# Altium project project.PrjPcb (part 2 of 2)

## Sheet klmag2gend-b031.SchDoc: EMMC
size A4; Date: 10.08.2025; CheckedBy: BCY; DrawnBy: miaow; DocumentNumber: 9; Revision: v0.0.1; SheetNumber: 9; SheetTotal: 12; Sample: A0; Url: github.com/miaow-cn/pcb-lib; Liscense: GPLv3; Board: MIAOW FOC BOARD; BoardType: MAIN_PCB; Desc: High speed DDR
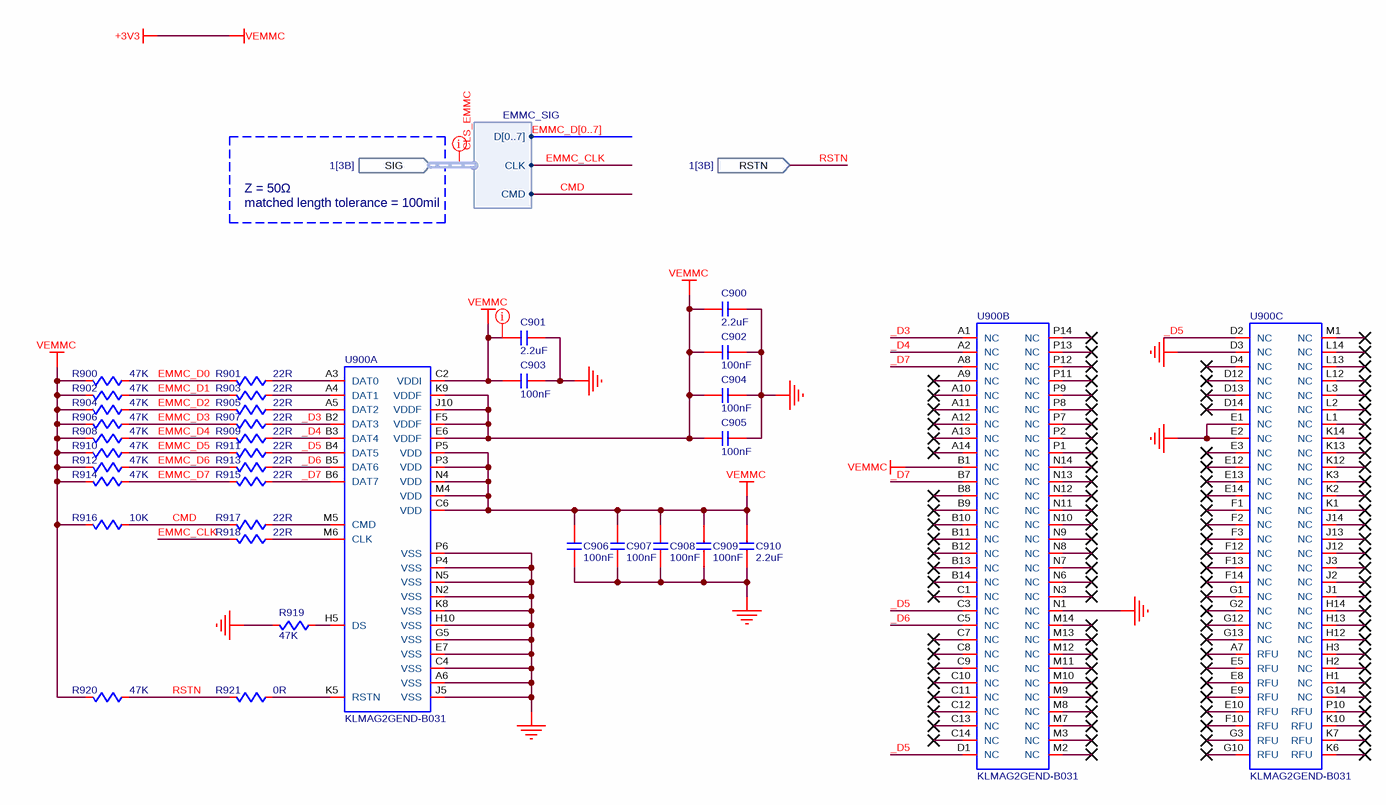
[diagram p8: klmag2gend-b031.SchDoc]

### Parts
C900  value 2.2uF  [C0603]  (hidden comment: C-NOMO)
C901  value 2.2uF  [C0603]  (hidden comment: C-NOMO)
C902  value 100nF  [C0402]  (hidden comment: C-NOMO)
C903  value 100nF  [C0402]  (hidden comment: C-NOMO)
C904  value 100nF  [C0402]  (hidden comment: C-NOMO)
C905  value 100nF  [C0402]  (hidden comment: C-NOMO)
C906  value 100nF  [C0402]  (hidden comment: C-NOMO)
C907  value 100nF  [C0402]  (hidden comment: C-NOMO)
C908  value 100nF  [C0402]  (hidden comment: C-NOMO)
C909  value 100nF  [C0402]  (hidden comment: C-NOMO)
C910  value 2.2uF  [C0603]  (hidden comment: C-NOMO)
R900  value 47K  [R0402]  (hidden comment: R)
R901  value 22R  [R0402]  (hidden comment: R)
R902  value 47K  [R0402]  (hidden comment: R)
R903  value 22R  [R0402]  (hidden comment: R)
R904  value 47K  [R0402]  (hidden comment: R)
R905  value 22R  [R0402]  (hidden comment: R)
R906  value 47K  [R0402]  (hidden comment: R)
R907  value 22R  [R0402]  (hidden comment: R)
R908  value 47K  [R0402]  (hidden comment: R)
R909  value 22R  [R0402]  (hidden comment: R)
R910  value 47K  [R0402]  (hidden comment: R)
R911  value 22R  [R0402]  (hidden comment: R)
R912  value 47K  [R0402]  (hidden comment: R)
R913  value 22R  [R0402]  (hidden comment: R)
R914  value 47K  [R0402]  (hidden comment: R)
R915  value 22R  [R0402]  (hidden comment: R)
R916  value 10K  [R0402]  (hidden comment: R)
R917  value 22R  [R0402]  (hidden comment: R)
R918  value 22R  [R0402]  (hidden comment: R)
R919  value 47K  [R0402]  (hidden comment: R)
R920  value 47K  [R0402]  (hidden comment: R)
R921  value 0R  [R0402]  (hidden comment: R)
U900  KLMAG2GEND-B031  [KLMAG2GEND-B031]  (parts A,B,C of 3)

### Ports
RSTN (in, see 1[3B]), SIG (in, harness EMMC_SIG, see 1[3B])

### Harnesses
EMMC_SIG: D[0..7], CLK, CMD

### Nets
+3V3: C900.2 C901.2 C902.2 C903.2 C904.2 C905.2 C906.2 C907.2 C908.2 C909.2 C910.2 R900.1 R902.1 R904.1 R906.1 R908.1 R910.1 R912.1 R914.1 R916.1 R920.1 U900.B1(NC) U900.C2(VDDI) U900.C6(VDD) U900.E6(VDDF) U900.F5(VDDF) U900.J10(VDDF) U900.K9(VDDF) U900.M4(VDD) U900.N4(VDD) U900.P3(VDD) U900.P5(VDD)  [also labelled VEMMC]
GND: C900.1 C901.1 C902.1 C903.1 C904.1 C905.1 C906.1 C907.1 C908.1 C909.1 C910.1 R919.1 U900.A6(VSS) U900.C4(VSS) U900.D3(NC) U900.E1(NC) U900.E2(NC) U900.E7(VSS) U900.G5(VSS) U900.H10(VSS) U900.J5(VSS) U900.K8(VSS) U900.N1(NC) U900.N2(VSS) U900.N5(VSS) U900.P4(VSS) U900.P6(VSS)  [project net GMCUA]
_D3: R907.2 U900.A1(NC) U900.B2(DAT3)
_D4: R909.2 U900.A2(NC) U900.B3(DAT4)
_D5: R911.2 U900.B4(DAT5) U900.C3(NC) U900.D1(NC) U900.D2(NC)
_D6: R913.2 U900.B5(DAT6) U900.C5(NC)
_D7: R915.2 U900.A8(NC) U900.B6(DAT7) U900.B7(NC)
CMD: R916.2 R917.1 ; port SIG.CMD
EMMC_CLK: R918.1 ; port SIG.CLK
EMMC_D0: R900.2 R901.1
EMMC_D1: R902.2 R903.1
EMMC_D2: R904.2 R905.1
EMMC_D3: R906.2 R907.1
EMMC_D4: R908.2 R909.1
EMMC_D5: R910.2 R911.1
EMMC_D6: R912.2 R913.1
EMMC_D7: R914.2 R915.1
RSTN: R920.2 R921.1 ; port RSTN  [project net NRST]
NetR901_2: R901.2 U900.A3(DAT0)
NetR903_2: R903.2 U900.A4(DAT1)
NetR905_2: R905.2 U900.A5(DAT2)
NetR917_2: R917.2 U900.M5(CMD)
NetR918_2: R918.2 U900.M6(CLK)
NetR919_2: R919.2 U900.H5(DS)
NetR921_2: R921.2 U900.K5(RSTN)

Not connected (* = marked no-connect by the designer): U900 A7(RFU)* A9(NC)* A10(NC)* A11(NC)* A12(NC)* A13(NC)* A14(NC)* B8(NC)* B9(NC)* B10(NC)* B11(NC)* B12(NC)* B13(NC)* B14(NC)* C1(NC)* C7(NC)* C8(NC)* C9(NC)* C10(NC)* C11(NC)* C12(NC)* C13(NC)* C14(NC)* D4(NC)* D12(NC)* D13(NC)* D14(NC)* E3(NC)* E5(RFU)* E8(RFU)* E9(RFU)* E10(RFU)* E12(NC)* E13(NC)* E14(NC)* F1(NC)* F2(NC)* F3(NC)* F10(RFU)* F12(NC)* F13(NC)* F14(NC)* G1(NC)* G2(NC)* G3(RFU)* G10(RFU)* G12(NC)* G13(NC)* G14(NC)* H1(NC)* H2(NC)* H3(NC)* H12(NC)* H13(NC)* H14(NC)* J1(NC)* J2(NC)* J3(NC)* J12(NC)* J13(NC)* J14(NC)* K1(NC)* K2(NC)* K3(NC)* K6(RFU)* K7(RFU)* K10(RFU)* K12(NC)* K13(NC)* K14(NC)* L1(NC)* L2(NC)* L3(NC)* L12(NC)* L13(NC)* L14(NC)* M1(NC)* M2(NC)* M3(NC)* M7(NC)* M8(NC)* M9(NC)* M10(NC)* M11(NC)* M12(NC)* M13(NC)* M14(NC)* N3(NC)* N6(NC)* N7(NC)* N8(NC)* N9(NC)* N10(NC)* N11(NC)* N12(NC)* N13(NC)* N14(NC)* P1(NC)* P2(NC)* P7(NC)* P8(NC)* P9(NC)* P10(RFU)* P11(NC)* P12(NC)* P13(NC)* P14(NC)*

### Buses and harness runs
bus EMMC_D[0..7]

### Layout directives
net class CLS_PWR: +3V3
net class CLS_EMMC: (no net found under the mark)

### Notes on the sheet
- Z = 50Ω
  matched length tolerance = 100mil
- DRAWN
- CHECKED
- DRAWNBY
- SHEETS
- SHEETS_NO

### Library data of the parts
C900-C910 = C-NOMO: voltage: 25V; precision: 5%
R900-R921 = R: precision: 1%
U900 = KLMAG2GEND-B031: EMMC; Supplier 1: Win Source; Supplier Part Number 1: 826874-KLMAG2GEND-B031

## Sheet mx25l25645gz2i-08g.SchDoc: NOR
size A4; Date: 10.08.2025; CheckedBy: BCY; DrawnBy: miaow; DocumentNumber: 10; Revision: v0.0.1; SheetNumber: 10; SheetTotal: 12; Sample: A0; Url: github.com/miaow-cn/pcb-lib; Liscense: GPLv3; Board: MIAOW FOC BOARD; BoardType: MAIN_PCB; Desc: qspi nor flash for xip
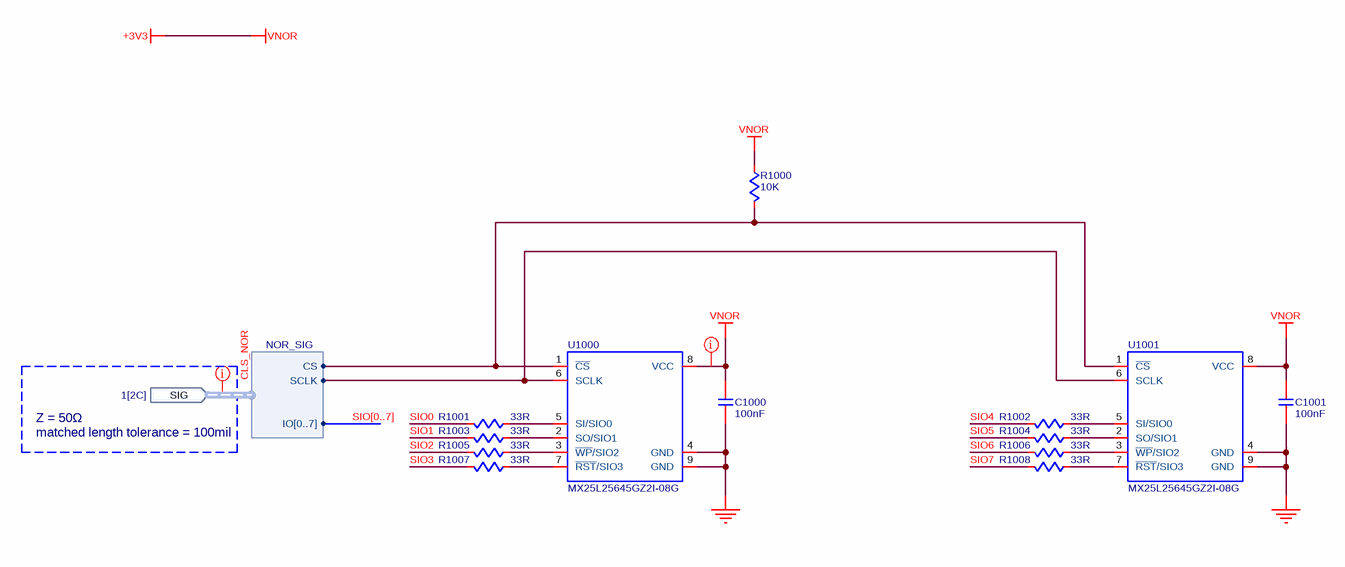
[diagram p9: mx25l25645gz2i-08g.SchDoc]

### Parts
C1000  value 100nF  [C0402]  (hidden comment: C-NOMO)
C1001  value 100nF  [C0402]  (hidden comment: C-NOMO)
R1000  value 10K  [R0402]  (hidden comment: R)
R1001  value 33R  [R0402]  (hidden comment: R)
R1002  value 33R  [R0402]  (hidden comment: R)
R1003  value 33R  [R0402]  (hidden comment: R)
R1004  value 33R  [R0402]  (hidden comment: R)
R1005  value 33R  [R0402]  (hidden comment: R)
R1006  value 33R  [R0402]  (hidden comment: R)
R1007  value 33R  [R0402]  (hidden comment: R)
R1008  value 33R  [R0402]  (hidden comment: R)
U1000  MX25L25645GZ2I-08G  [MX25L25645GZ2I-08G]
U1001  MX25L25645GZ2I-08G  [MX25L25645GZ2I-08G]

### Ports
SIG (in, harness NOR_SIG, see 1[2C])

### Harnesses
NOR_SIG: CS, SCLK, IO[0..7]

### Nets
+3V3: C1000.2 C1001.2 R1000.2 U1000.8(VCC) U1001.8(VCC)  [also labelled VNOR]
GND: C1000.1 C1001.1 U1000.4(GND) U1000.9(GND) U1001.4(GND) U1001.9(GND)  [project net GMCUA]
NOR_CS: R1000.1 U1000.1(~{CS}) U1001.1(~{CS}) ; port SIG.CS
NOR_SCLK: U1000.6(SCLK) U1001.6(SCLK) ; port SIG.SCLK
SIO0: R1001.1  [project net NOR_IO0]
SIO1: R1003.1  [project net NOR_IO1]
SIO2: R1005.1  [project net NOR_IO2]
SIO3: R1007.1  [project net NOR_IO3]
SIO4: R1002.1  [project net NOR_IO4]
SIO5: R1004.1  [project net NOR_IO5]
SIO6: R1006.1  [project net NOR_IO6]
SIO7: R1008.1  [project net NOR_IO7]
NetR1001_2: R1001.2 U1000.5(SI/SIO0)
NetR1002_2: R1002.2 U1001.5(SI/SIO0)
NetR1003_2: R1003.2 U1000.2(SO/SIO1)
NetR1004_2: R1004.2 U1001.2(SO/SIO1)
NetR1005_2: R1005.2 U1000.3(~{WP}/SIO2)
NetR1006_2: R1006.2 U1001.3(~{WP}/SIO2)
NetR1007_2: R1007.2 U1000.7(~{RST}/SIO3)
NetR1008_2: R1008.2 U1001.7(~{RST}/SIO3)

### Buses and harness runs
bus SIO[0..7]

### Layout directives
net class CLS_NOR: (no net found under the mark)
net class CLS_PWR: +3V3

### Notes on the sheet
- Z = 50Ω
  matched length tolerance = 100mil
- DRAWN
- CHECKED
- DRAWNBY
- SHEETS
- SHEETS_NO

### Library data of the parts
C1000 C1001 = C-NOMO: voltage: 25V; precision: 5%
R1000-R1008 = R: precision: 1%
U1000 U1001 = MX25L25645GZ2I-08G: Supplier 1: LCSC; Supplier Part Number 1: C2802978

## Sheet debug.SchDoc: DBG
size A4; Date: 10.11.2025; CheckedBy: BCY; DrawnBy: miaow; DocumentNumber: 11; Revision: v0.0.1; SheetNumber: 11; SheetTotal: 12; Sample: A0; Url: github.com/miaow-cn/pcb-lib; Liscense: GPLv3; Board: MIAOW FOC BOARD; BoardType: MAIN_PCB; Desc: debug board interface
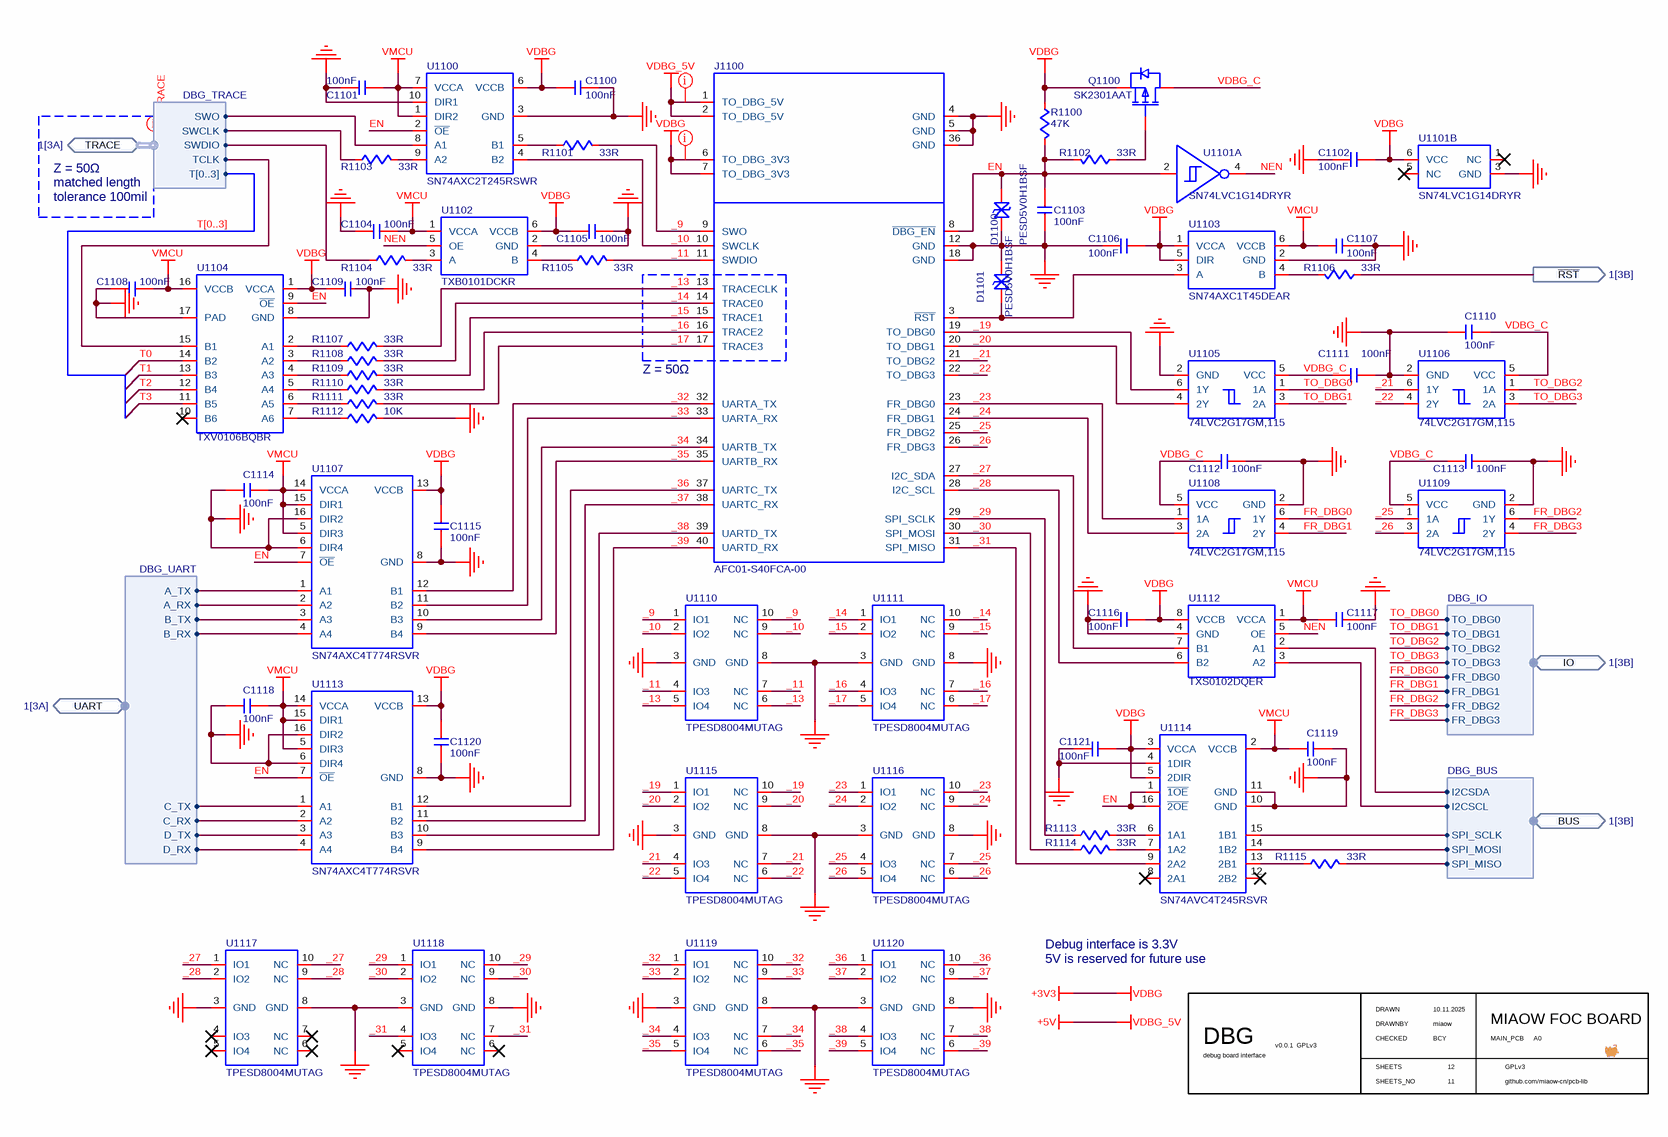
[diagram p10: debug.SchDoc]

### Parts
C1100  value 100nF  [C0402]  (hidden comment: C-NOMO)
C1101  value 100nF  [C0402]  (hidden comment: C-NOMO)
C1102  value 100nF  [C0402]  (hidden comment: C-NOMO)
C1103  value 100nF  [C0402]  (hidden comment: C-NOMO)
C1104  value 100nF  [C0402]  (hidden comment: C-NOMO)
C1105  value 100nF  [C0402]  (hidden comment: C-NOMO)
C1106  value 100nF  [C0402]  (hidden comment: C-NOMO)
C1107  value 100nF  [C0402]  (hidden comment: C-NOMO)
C1108  value 100nF  [C0402]  (hidden comment: C-NOMO)
C1109  value 100nF  [C0402]  (hidden comment: C-NOMO)
C1110  value 100nF  [C0402]  (hidden comment: C-NOMO)
C1111  value 100nF  [C0402]  (hidden comment: C-NOMO)
C1112  value 100nF  [C0402]  (hidden comment: C-NOMO)
C1113  value 100nF  [C0402]  (hidden comment: C-NOMO)
C1114  value 100nF  [C0402]  (hidden comment: C-NOMO)
C1115  value 100nF  [C0402]  (hidden comment: C-NOMO)
C1116  value 100nF  [C0402]  (hidden comment: C-NOMO)
C1117  value 100nF  [C0402]  (hidden comment: C-NOMO)
C1118  value 100nF  [C0402]  (hidden comment: C-NOMO)
C1119  value 100nF  [C0402]  (hidden comment: C-NOMO)
C1120  value 100nF  [C0402]  (hidden comment: C-NOMO)
C1121  value 100nF  [C0402]  (hidden comment: C-NOMO)
D1100  PESD5V0H1BSF  [PESD5V0H1BSF]
D1101  PESD5V0H1BSF  [PESD5V0H1BSF]
J1100  AFC01-S40FCA-00  [AFC01-S40FCA-00]
Q1100  SK2301AAT  [SK2301AAT]
R1100  value 47K  [R0402]  (hidden comment: R)
R1101  value 33R  [R0402]  (hidden comment: R)
R1102  value 33R  [R0402]  (hidden comment: R)
R1103  value 33R  [R0402]  (hidden comment: R)
R1104  value 33R  [R0402]  (hidden comment: R)
R1105  value 33R  [R0402]  (hidden comment: R)
R1106  value 33R  [R0402]  (hidden comment: R)
R1107  value 33R  [R0402]  (hidden comment: R)
R1108  value 33R  [R0402]  (hidden comment: R)
R1109  value 33R  [R0402]  (hidden comment: R)
R1110  value 33R  [R0402]  (hidden comment: R)
R1111  value 33R  [R0402]  (hidden comment: R)
R1112  value 10K  [R0402]  (hidden comment: R)
R1113  value 33R  [R0402]  (hidden comment: R)
R1114  value 33R  [R0402]  (hidden comment: R)
R1115  value 33R  [R0402]  (hidden comment: R)
U1100  SN74AXC2T245RSWR  [SN74AXC2T245RSWR]
U1101  SN74LVC1G14DRYR  [SN74LVC1G14DRYR]  (parts A,B of 2)
U1102  TXB0101DCKR  [TXB0101DCKR]
U1103  SN74AXC1T45DEAR  [SN74AXC1T45DEAR]
U1104  TXV0106BQBR  [TXV0106BQBR]
U1105  74LVC2G17GM,115  [74LVC2G17GM,115]
U1106  74LVC2G17GM,115  [74LVC2G17GM,115]
U1107  SN74AXC4T774RSVR  [SN74AXC4T774RSVR]
U1108  74LVC2G17GM,115  [74LVC2G17GM,115]
U1109  74LVC2G17GM,115  [74LVC2G17GM,115]
U1110  TPESD8004MUTAG  [TPESD8004MUTAG]
U1111  TPESD8004MUTAG  [TPESD8004MUTAG]
U1112  TXS0102DQER  [TXS0102DQER]
U1113  SN74AXC4T774RSVR  [SN74AXC4T774RSVR]
U1114  SN74AVC4T245RSVR  [SN74AVC4T245RSVR]
U1115  TPESD8004MUTAG  [TPESD8004MUTAG]
U1116  TPESD8004MUTAG  [TPESD8004MUTAG]
U1117  TPESD8004MUTAG  [TPESD8004MUTAG]
U1118  TPESD8004MUTAG  [TPESD8004MUTAG]
U1119  TPESD8004MUTAG  [TPESD8004MUTAG]
U1120  TPESD8004MUTAG  [TPESD8004MUTAG]

### Ports
BUS (bidir, harness DBG_BUS, see 1[3B]), IO (bidir, harness DBG_IO, see 1[3B]), TRACE (bidir, harness DBG_TRACE, see 1[3A]), UART (bidir, harness DBG_UART, see 1[3A]), ~{RST} (out, see 1[3B])

### Harnesses
DBG_UART: A_TX, A_RX, B_TX, B_RX, C_TX, C_RX, D_TX, D_RX
DBG_TRACE: SWO, SWCLK, SWDIO, TCLK, T[0..3]
DBG_BUS: I2CSDA, I2CSCL, SPI_MISO, SPI_MOSI, SPI_SCLK
DBG_IO: TO_DBG0, TO_DBG1, FR_DBG0, TO_DBG3, TO_DBG2, FR_DBG1, FR_DBG2, FR_DBG3

### Nets
+3V3: C1100.2 C1101.1 C1102.2 C1104.2 C1105.1 C1106.2 C1107.1 C1108.1 C1109.1 C1114.1 C1115.2 C1116.2 C1117.1 C1118.1 C1119.1 C1120.2 C1121.2 J1100.6(TO_DBG_3V3) J1100.7(TO_DBG_3V3) Q1100.S R1100.1 U1100.1(DIR2) U1100.6(VCCB) U1100.7(VCCA) U1101.6(VCC) U1102.1(VCCA) U1102.6(VCCB) U1103.1(VCCA) U1103.5(DIR) U1103.6(VCCB) U1104.1(VCCA) U1104.16(VCCB) U1107.5(DIR3) U1107.13(VCCB) U1107.14(VCCA) U1107.15(DIR1) U1112.1(VCCA) U1112.8(VCCB) U1113.5(DIR3) U1113.13(VCCB) U1113.14(VCCA) U1113.15(DIR1) U1114.2(VCCB) U1114.3(VCCA) U1114.5(2DIR)  [also labelled VDBG, VMCU]
+5V: J1100.1(TO_DBG_5V) J1100.2(TO_DBG_5V)  [also labelled VDBG_5V]
GND: C1100.1 C1101.2 C1102.1 C1103.2 C1104.1 C1105.2 C1106.1 C1107.2 C1108.2 C1109.2 C1110.1 C1111.2 C1112.1 C1113.1 C1114.2 C1115.1 C1116.1 C1117.2 C1118.2 C1119.2 C1120.1 C1121.1 D1100.1 D1101.2 J1100.4(GND) J1100.5(GND) J1100.12(GND) J1100.18(GND) J1100.36(GND) R1112.2 U1100.3(GND) U1100.10(DIR1) U1101.3(GND) U1102.2(GND) U1103.2(GND) U1104.8(GND) U1104.17(PAD) U1105.2(GND) U1106.2(GND) U1107.6(DIR4) U1107.8(GND) U1107.16(DIR2) U1108.2(GND) U1109.2(GND) U1110.3(GND) U1110.8(GND) U1111.3(GND) U1111.8(GND) U1112.4(GND) U1113.6(DIR4) U1113.8(GND) U1113.16(DIR2) U1114.4(1DIR) U1114.10(GND) U1114.11(GND) U1115.3(GND) U1115.8(GND) U1116.3(GND) U1116.8(GND) U1117.3(GND) U1117.8(GND) U1118.3(GND) U1118.8(GND) U1119.3(GND) U1119.8(GND) U1120.3(GND) U1120.8(GND)  [project net GMCUA]
_9: J1100.9(SWO) R1101.2 U1110.1(IO1) U1110.10(NC)
_10: J1100.10(SWCLK) U1100.4(B2) U1110.2(IO2) U1110.9(NC)
_11: J1100.11(SWDIO) R1105.2 U1110.4(IO3) U1110.7(NC)
_13: J1100.13(TRACECLK) R1107.2 U1110.5(IO4) U1110.6(NC)
_14: J1100.14(TRACE0) R1108.2 U1111.1(IO1) U1111.10(NC)
_15: J1100.15(TRACE1) R1109.2 U1111.2(IO2) U1111.9(NC)
_16: J1100.16(TRACE2) R1110.2 U1111.4(IO3) U1111.7(NC)
_17: J1100.17(TRACE3) R1111.2 U1111.5(IO4) U1111.6(NC)
_19: J1100.19(TO_DBG0) U1105.6(1Y) U1115.1(IO1) U1115.10(NC)
_20: J1100.20(TO_DBG1) U1105.4(2Y) U1115.2(IO2) U1115.9(NC)
_21: J1100.21(TO_DBG2) U1106.6(1Y) U1115.4(IO3) U1115.7(NC)
_22: J1100.22(TO_DBG3) U1106.4(2Y) U1115.5(IO4) U1115.6(NC)
_23: J1100.23(FR_DBG0) U1108.1(1A) U1116.1(IO1) U1116.10(NC)
_24: J1100.24(FR_DBG1) U1108.3(2A) U1116.2(IO2) U1116.9(NC)
_25: J1100.25(FR_DBG2) U1109.1(1A) U1116.4(IO3) U1116.7(NC)
_26: J1100.26(FR_DBG3) U1109.3(2A) U1116.5(IO4) U1116.6(NC)
_27: J1100.27(I2C_SDA) U1112.7(B1) U1117.1(IO1) U1117.10(NC)
_28: J1100.28(I2C_SCL) U1112.6(B2) U1117.2(IO2) U1117.9(NC)
_29: J1100.29(SPI_SCLK) R1113.1 U1118.1(IO1) U1118.10(NC)
_30: J1100.30(SPI_MOSI) R1114.1 U1118.2(IO2) U1118.9(NC)
_31: J1100.31(SPI_MISO) U1114.9(2A2) U1118.4(IO3) U1118.7(NC)
_32: J1100.32(UARTA_TX) U1107.12(B1) U1119.1(IO1) U1119.10(NC)
_33: J1100.33(UARTA_RX) U1107.11(B2) U1119.2(IO2) U1119.9(NC)
_34: J1100.34(UARTB_TX) U1107.10(B3) U1119.4(IO3) U1119.7(NC)
_35: J1100.35(UARTB_RX) U1107.9(B4) U1119.5(IO4) U1119.6(NC)
_36: J1100.37(UARTC_TX) U1113.12(B1) U1120.1(IO1) U1120.10(NC)
_37: J1100.38(UARTC_RX) U1113.11(B2) U1120.2(IO2) U1120.9(NC)
_38: J1100.39(UARTD_TX) U1113.10(B3) U1120.4(IO3) U1120.7(NC)
_39: J1100.40(UARTD_RX) U1113.9(B4) U1120.5(IO4) U1120.6(NC)
DBG_A_RX: U1107.2(A2) ; port UART.A_RX
DBG_A_TX: U1107.1(A1) ; port UART.A_TX
DBG_B_RX: U1107.4(A4) ; port UART.B_RX
DBG_B_TX: U1107.3(A3) ; port UART.B_TX
DBG_C_RX: U1113.2(A2) ; port UART.C_RX
DBG_C_TX: U1113.1(A1) ; port UART.C_TX
DBG_D_RX: U1113.4(A4) ; port UART.D_RX
DBG_D_TX: U1113.3(A3) ; port UART.D_TX
DBG_MISO: R1115.2 ; port BUS.SPI_MISO
DBG_MOSI: U1114.14(1B2) ; port BUS.SPI_MOSI
DBG_SCL: U1112.3(A2) ; port BUS.I2CSCL
DBG_SCLK: U1114.15(1B1) ; port BUS.SPI_SCLK
DBG_SDA: U1112.2(A1) ; port BUS.I2CSDA
EN: C1103.1 D1100.2 J1100.8(~{DBG_EN}) R1100.2 R1102.2 U1100.2(~{OE}) U1101.2(A) U1104.9(~{OE}) U1107.7(~{OE}) U1113.7(~{OE}) U1114.1(~{1OE}) U1114.16(~{2OE})
FR_DBG0: U1108.6(1Y) ; port IO.FR_DBG0  [project net BOOT0]
FR_DBG1: U1108.4(2Y) ; port IO.FR_DBG1
FR_DBG2: U1109.6(1Y) ; port IO.FR_DBG2
FR_DBG3: U1109.4(2Y) ; port IO.FR_DBG3
NEN: U1101.4(Y) U1102.5(OE) U1112.5(OE)
NRST: R1106.1 ; port ~{RST}
SWCLK: R1103.1 ; port TRACE.SWCLK
SWDIO: R1104.1 ; port TRACE.SWDIO
SWO: U1100.8(A1) ; port TRACE.SWO
T0: U1104.14(B2)
T1: U1104.13(B3)
T2: U1104.12(B4)
T3: U1104.11(B5)
TCLK: U1104.15(B1) ; port TRACE.TCLK
TO_DBG0: U1105.1(1A) ; port IO.TO_DBG0
TO_DBG1: U1105.3(2A) ; port IO.TO_DBG1
TO_DBG2: U1106.1(1A) ; port IO.TO_DBG2
TO_DBG3: U1106.3(2A) ; port IO.TO_DBG3
VDBG_C: C1110.2 C1111.1 C1112.2 C1113.2 Q1100.D U1105.5(VCC) U1106.5(VCC) U1108.5(VCC) U1109.5(VCC)
NetD1101_1: D1101.1 J1100.3(~{RST}) U1103.3(A)
NetQ1100_G: Q1100.G R1102.1
NetR1101_1: R1101.1 U1100.5(B1)
NetR1103_2: R1103.2 U1100.9(A2)
NetR1104_2: R1104.2 U1102.3(A)
NetR1105_1: R1105.1 U1102.4(B)
NetR1106_2: R1106.2 U1103.4(B)
NetR1107_1: R1107.1 U1104.2(A1)
NetR1108_1: R1108.1 U1104.3(A2)
NetR1109_1: R1109.1 U1104.4(A3)
NetR1110_1: R1110.1 U1104.5(A4)
NetR1111_1: R1111.1 U1104.6(A5)
NetR1112_1: R1112.1 U1104.7(A6)
NetR1113_2: R1113.2 U1114.6(1A1)
NetR1114_2: R1114.2 U1114.7(1A2)
NetR1115_1: R1115.1 U1114.13(2B1)

Not connected (* = marked no-connect by the designer): U1101 1(NC)* 5(NC)*; U1104 10(B6)*; U1114 8(2A1)* 12(2B2)*; U1117 4(IO3)* 5(IO4)* 6(NC)* 7(NC)*; U1118 5(IO4)* 6(NC)*

### Buses and harness runs
bus T[0..3]

### Layout directives
net class CLS_PWR: +3V3, +5V
net class CLS_TRACE: (no net found under the mark)

### Notes on the sheet
- Z = 50Ω
  matched length tolerance 100mil
- (near J1100) Z = 50Ω
- Debug interface is 3.3V
  5V is reserved for future use
- DRAWN
- CHECKED
- DRAWNBY
- SHEETS
- SHEETS_NO

### Library data of the parts
C1100-C1121 = C-NOMO: voltage: 25V; precision: 5%
D1100 D1101 = PESD5V0H1BSF: TVS/ESD; Supplier 1: LCSC; Supplier Part Number 1: C477989
J1100 = FPC-DEBUG: FPC; Supplier 1: LCSC; Supplier Part Number 1: C262674
Q1100 = SK2301AAT: PMOS; Supplier 1: LCSC; Supplier Part Number 1: C5334586
R1100-R1115 = R: precision: 1%
U1100 = SN74AXC2T245RSWR: LEVEL SHIFT; Supplier 1: LCSC; Supplier Part Number 1: C1882550
U1101 = SN74LVC1G14DRYR: INVERTER - 1bit schmitt; Supplier 1: LCSC; Supplier Part Number 1: C2878125
U1102 = TXB0101DCKR: LEVEL SHIFT; Supplier 1: LCSC; Supplier Part Number 1: C324081
U1103 = SN74AXC1T45DEAR: LEVEL SHIFT - 1bit, 0.65V - 3.6V, 500Mbps; Supplier 1: LCSC; Supplier Part Number 1: C2677436
U1104 = TXV0106BQBR: LEVEL SHIFT; Supplier 1: LCSC; Supplier Part Number 1: C22414342
U1105 U1106 U1108 U1109 = 74LVC2G17GM,115: SCHMITT - 2bits; Supplier 1: LCSC; Supplier Part Number 1: C548609
U1107 U1113 = SN74AXC4T774RSVR: LEVEL SHIFT - 4bits, 0.65V - 3.6V, 310Mbps; Supplier 1: LCSC; Supplier Part Number 1: C779392
U1110 U1111 U1115-U1120 = TPESD8004MUTAG: TVS/ESD; Supplier 1: LCSC; Supplier Part Number 1: C2827679
U1114 = SN74AVC4T245RSVR: LEVEL SHIFT - 4bits, 2grps, 1.2V - 3.6V, 380Mbps; Supplier 1: LCSC; Supplier Part Number 1: C133244
U1112 = TXS0102DQER: Supplier Part Number 1: C2652935; Supplier 1: LCSC; ComponentLink1Description: Datasheet; ComponentLink1URL: ..\ds\txs0102dqer.pdf

## Sheet tempature.SchDoc: NTC
size A4; Date: 10.18.2025; CheckedBy: BCY; DrawnBy: miaow; DocumentNumber: 12; Revision: v0.0.1; SheetNumber: 12; SheetTotal: 12; Sample: A0; Url: github.com/miaow-cn/pcb-lib; Liscense: GPLv3; Board: MIAOW FOC BOARD; BoardType: MAIN_PCB; Desc: ntc tempature sensors
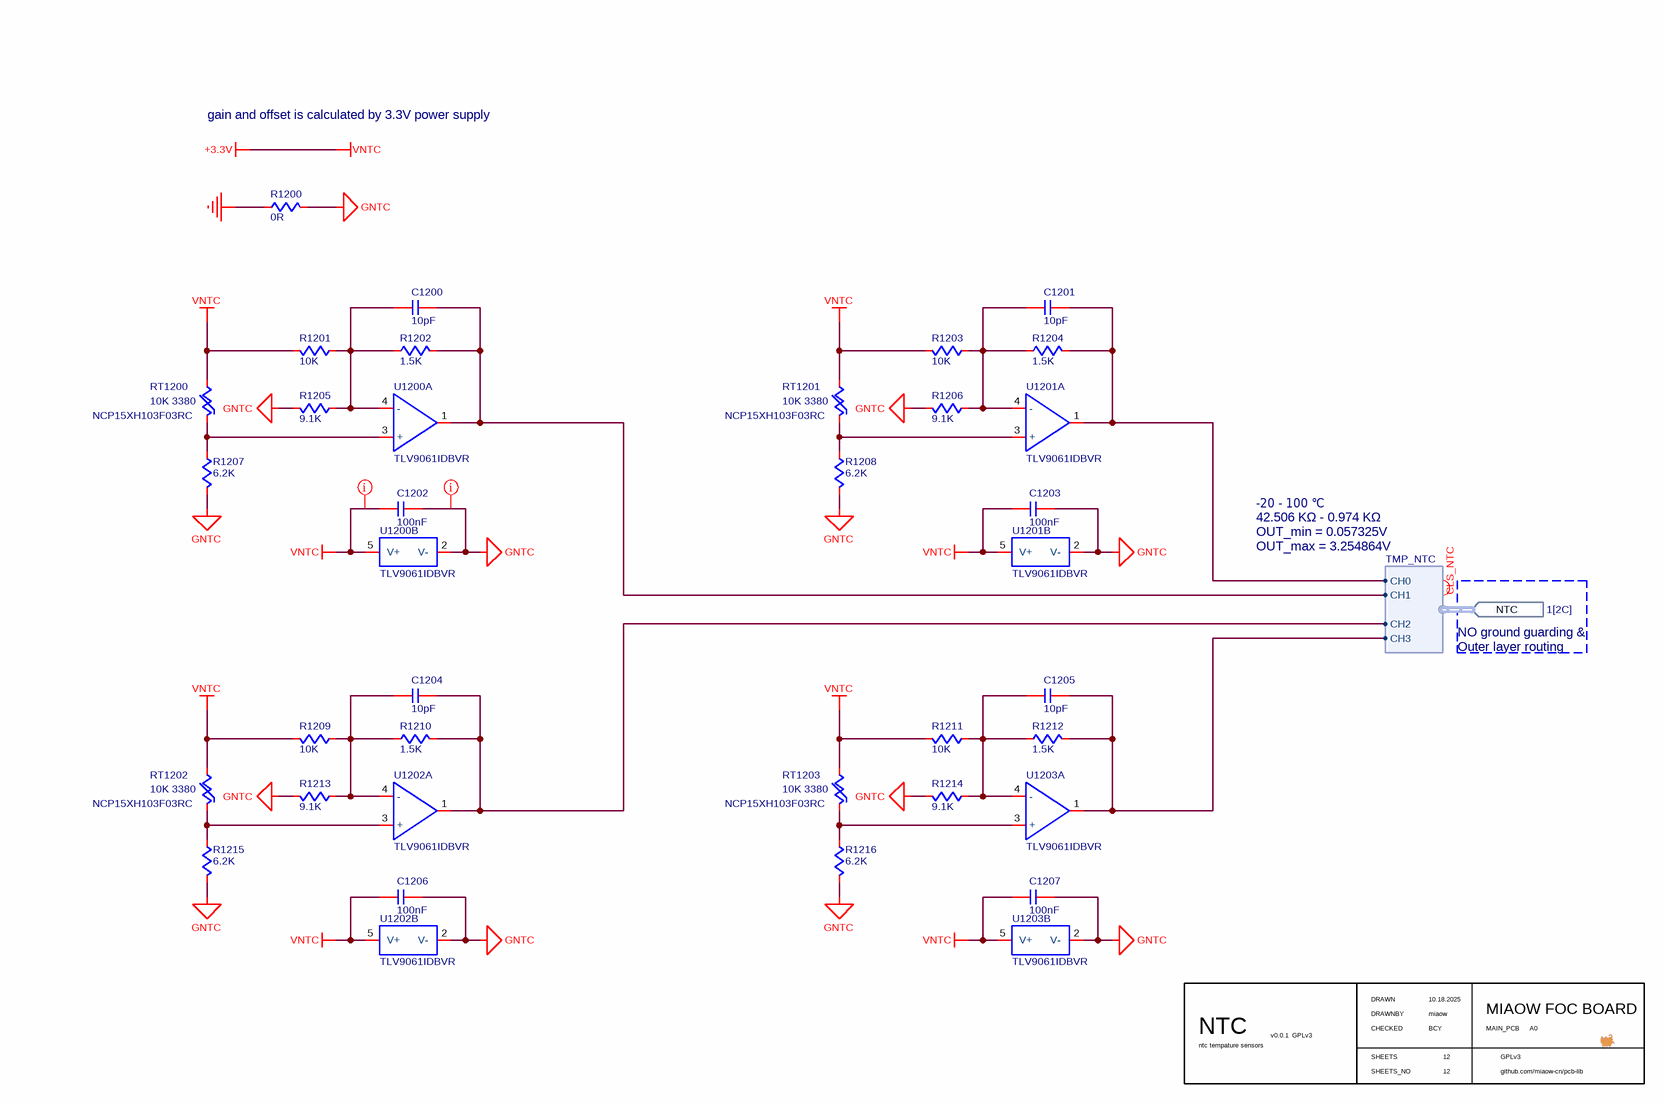
[diagram p11: tempature.SchDoc]

### Parts
C1200  value 10pF  [C0402]  (hidden comment: C-NOMO)
C1201  value 10pF  [C0402]  (hidden comment: C-NOMO)
C1202  value 100nF  [C0402]  (hidden comment: C-NOMO)
C1203  value 100nF  [C0402]  (hidden comment: C-NOMO)
C1204  value 10pF  [C0402]  (hidden comment: C-NOMO)
C1205  value 10pF  [C0402]  (hidden comment: C-NOMO)
C1206  value 100nF  [C0402]  (hidden comment: C-NOMO)
C1207  value 100nF  [C0402]  (hidden comment: C-NOMO)
R1200  value 0R  [R0402]  (hidden comment: R)
R1201  value 10K  [R0402]  (hidden comment: R)
R1202  value 1.5K  [R0402]  (hidden comment: R)
R1203  value 10K  [R0402]  (hidden comment: R)
R1204  value 1.5K  [R0402]  (hidden comment: R)
R1205  value 9.1K  [R0402]  (hidden comment: R)
R1206  value 9.1K  [R0402]  (hidden comment: R)
R1207  value 6.2K  [R0402]  (hidden comment: R)
R1208  value 6.2K  [R0402]  (hidden comment: R)
R1209  value 10K  [R0402]  (hidden comment: R)
R1210  value 1.5K  [R0402]  (hidden comment: R)
R1211  value 10K  [R0402]  (hidden comment: R)
R1212  value 1.5K  [R0402]  (hidden comment: R)
R1213  value 9.1K  [R0402]  (hidden comment: R)
R1214  value 9.1K  [R0402]  (hidden comment: R)
R1215  value 6.2K  [R0402]  (hidden comment: R)
R1216  value 6.2K  [R0402]  (hidden comment: R)
RT1200  NCP15XH103F03RC  value 10K 3380  [NTC0402]
RT1201  NCP15XH103F03RC  value 10K 3380  [NTC0402]
RT1202  NCP15XH103F03RC  value 10K 3380  [NTC0402]
RT1203  NCP15XH103F03RC  value 10K 3380  [NTC0402]
U1200  TLV9061IDBVR  [TLV9061IDBVR]  (parts A,B of 2)
U1201  TLV9061IDBVR  [TLV9061IDBVR]  (parts A,B of 2)
U1202  TLV9061IDBVR  [TLV9061IDBVR]  (parts A,B of 2)
U1203  TLV9061IDBVR  [TLV9061IDBVR]  (parts A,B of 2)

### Ports
NTC (in, harness TMP_NTC, see 1[2C])

### Harnesses
TMP_NTC: CH0, CH1, CH2, CH3

### Nets
+3.3V: C1202.2 C1203.2 C1206.2 C1207.2 R1201.1 R1203.1 R1209.1 R1211.1 RT1200.2 RT1201.2 RT1202.2 RT1203.2 U1200.5(V+) U1201.5(V+) U1202.5(V+) U1203.5(V+)  [also labelled VNTC]
GND: R1200.2  [project net GMCUA]
GNTC: C1202.1 C1203.1 C1206.1 C1207.1 R1200.1 R1205.1 R1206.1 R1207.1 R1208.1 R1213.1 R1214.1 R1215.1 R1216.1 U1200.2(V-) U1201.2(V-) U1202.2(V-) U1203.2(V-)
TMP_CH0: C1201.1 R1204.1 U1201.1(OUT) ; port NTC.CH0
TMP_CH1: C1200.1 R1202.1 U1200.1(OUT) ; port NTC.CH1
NetC1200_2: C1200.2 R1201.2 R1202.2 R1205.2 U1200.4(-)
NetC1201_2: C1201.2 R1203.2 R1204.2 R1206.2 U1201.4(-)
NetC1204_1: C1204.1 R1210.1 U1202.1(OUT) ; port NTC.CH2
NetC1204_2: C1204.2 R1209.2 R1210.2 R1213.2 U1202.4(-)
NetC1205_1: C1205.1 R1212.1 U1203.1(OUT) ; port NTC.CH3
NetC1205_2: C1205.2 R1211.2 R1212.2 R1214.2 U1203.4(-)
NetR1207_2: R1207.2 RT1200.1 U1200.3(+)
NetR1208_2: R1208.2 RT1201.1 U1201.3(+)
NetR1215_2: R1215.2 RT1202.1 U1202.3(+)
NetR1216_2: R1216.2 RT1203.1 U1203.3(+)

### Layout directives
net class CLS_PWR: +3.3V, GNTC
net class CLS_NTC: (no net found under the mark)

### Notes on the sheet
- gain and offset is calculated by 3.3V power supply
- -20 - 100 ℃
  42.506 KΩ - 0.974 KΩ
  OUT_min = 0.057325V
  OUT_max = 3.254864V
- NO ground guarding &
  Outer layer routing
- DRAWN
- CHECKED
- DRAWNBY
- SHEETS
- SHEETS_NO

### Library data of the parts
C1200-C1207 = C-NOMO: voltage: 25V; precision: 5%
R1200-R1216 = R: precision: 1%
RT1200-RT1203 = NCP15XH103F03RC: NTC - 10K, 3380, 1%; precision: 1%; Supplier Part Number 1: C13564; Supplier 1: LCSC
U1200-U1203 = TLV9061IDBVR: OPA - 1ch, 1.8V - 5.5V, r2r, 0.3mV, 10MHz, 10nVHz^0.5, 0.5pA; Supplier 1: LCSC; Supplier Part Number 1: C398358

## Nets that join several sheets
+3V3: drv8323 (7 pins), is42s32800j (28 pins), tps62130 (6 pins), stm32h750xbh6-pwr (55 pins), stm32h750xbh6-sig (11 pins), lcd (J800.6 J800.7), klmag2gend-b031 (32 pins), mx25l25645gz2i-08g (5 pins), debug (45 pins)
+5V: tps62130 (6 pins), lcd (J800.1 J800.2), debug (J1100.1 J1100.2)
DRV_PGND: drv8323 (18 pins), tps62130 (6 pins)
DRV_VDRAIN: drv8323 (21 pins), tps62130 (6 pins)
GMCUA: drv8323 (7 pins), is42s32800j (28 pins), tps62130 (29 pins), stm32h750xbh6-pwr (84 pins), stm32h750xbh6-sig (9 pins), lcd (20 pins), klmag2gend-b031 (27 pins), mx25l25645gz2i-08g (6 pins), debug (67 pins), tempature (R1200.2)
A0: is42s32800j (U400.G8), stm32h750xbh6-sig (R763.2)
A1: is42s32800j (U400.G9), stm32h750xbh6-sig (R765.2)
A2: is42s32800j (U400.F7), stm32h750xbh6-sig (R766.2)
A3: is42s32800j (U400.F3), stm32h750xbh6-sig (R767.2)
A4: is42s32800j (U400.G1), stm32h750xbh6-sig (R768.2)
A5: is42s32800j (U400.G2), stm32h750xbh6-sig (R769.2)
A6: is42s32800j (U400.G3), stm32h750xbh6-sig (R779.2)
A7: is42s32800j (U400.H1), stm32h750xbh6-sig (R780.2)
A8: is42s32800j (U400.H2), stm32h750xbh6-sig (R782.2)
A9: is42s32800j (U400.J3), stm32h750xbh6-sig (R783.2)
A10: is42s32800j (U400.G7), stm32h750xbh6-sig (R701.2)
A11: is42s32800j (U400.H9), stm32h750xbh6-sig (R704.2)
B0: stm32h750xbh6-sig (U600.D11), lcd (J800.12 U801.1 U801.10)
B1: stm32h750xbh6-sig (U600.C9), lcd (J800.16 U802.1 U802.10)
B2: stm32h750xbh6-sig (U600.E14), lcd (J800.19 U802.5 U802.6)
B3: stm32h750xbh6-sig (U600.B10), lcd (J800.18 U802.4 U802.7)
B4: stm32h750xbh6-sig (U600.C8), lcd (J800.17 U802.2 U802.9)
B5: stm32h750xbh6-sig (U600.B8), lcd (J800.15 U801.5 U801.6)
B6: stm32h750xbh6-sig (U600.A8), lcd (J800.14 U801.4 U801.7)
B7: stm32h750xbh6-sig (U600.C7), lcd (J800.13 U801.2 U801.9)
BA0: is42s32800j (U400.J7), stm32h750xbh6-sig (R709.2)
BA1: is42s32800j (U400.H8), stm32h750xbh6-sig (R712.2)
BL: stm32h750xbh6-sig (U600.A14), lcd (D800.1 J800.3)
BOOT0: stm32h750xbh6-sig (C702.1 R785.2 U600.E8), debug (U1108.6)
CLK: stm32h750xbh6-sig (U600.H3), lcd (J800.37)
CMD: stm32h750xbh6-sig (U600.C11), klmag2gend-b031 (R916.2 R917.1)
D0: is42s32800j (U400.R8), stm32h750xbh6-sig (R729.2)
D1: is42s32800j (U400.N7), stm32h750xbh6-sig (R731.2)
D2: is42s32800j (U400.R9), stm32h750xbh6-sig (R700.2)
D3: is42s32800j (U400.N8), stm32h750xbh6-sig (R703.2)
D4: is42s32800j (U400.P9), stm32h750xbh6-sig (R746.2)
D5: is42s32800j (U400.M8), stm32h750xbh6-sig (R748.2)
D6: is42s32800j (U400.M7), stm32h750xbh6-sig (R750.2)
D7: is42s32800j (U400.L8), stm32h750xbh6-sig (R752.2)
D8: is42s32800j (U400.L2), stm32h750xbh6-sig (R754.2)
D9: is42s32800j (U400.M3), stm32h750xbh6-sig (R756.2)
D10: is42s32800j (U400.M2), stm32h750xbh6-sig (R758.2)
D11: is42s32800j (U400.P1), stm32h750xbh6-sig (R760.2)
D12: is42s32800j (U400.N2), stm32h750xbh6-sig (R761.2)
D13: is42s32800j (U400.R1), stm32h750xbh6-sig (R717.2)
D14: is42s32800j (U400.N3), stm32h750xbh6-sig (R720.2)
D15: is42s32800j (U400.R2), stm32h750xbh6-sig (R724.2)
D16: is42s32800j (U400.E8), stm32h750xbh6-sig (R745.2)
D17: is42s32800j (U400.D7), stm32h750xbh6-sig (R747.2)
D18: is42s32800j (U400.D8), stm32h750xbh6-sig (R749.2)
D19: is42s32800j (U400.B9), stm32h750xbh6-sig (R751.2)
D20: is42s32800j (U400.C8), stm32h750xbh6-sig (R753.2)
D21: is42s32800j (U400.A9), stm32h750xbh6-sig (R755.2)
D22: is42s32800j (U400.C7), stm32h750xbh6-sig (R757.2)
D23: is42s32800j (U400.A8), stm32h750xbh6-sig (R759.2)
D24: is42s32800j (U400.A2), stm32h750xbh6-sig (R702.2)
D25: is42s32800j (U400.C3), stm32h750xbh6-sig (R705.2)
D26: is42s32800j (U400.A1), stm32h750xbh6-sig (R706.2)
D27: is42s32800j (U400.C2), stm32h750xbh6-sig (R707.2)
D28: is42s32800j (U400.B1), stm32h750xbh6-sig (R714.2)
D29: is42s32800j (U400.D2), stm32h750xbh6-sig (R716.2)
D30: is42s32800j (U400.D3), stm32h750xbh6-sig (R722.2)
D31: is42s32800j (U400.E2), stm32h750xbh6-sig (R725.2)
DBG_A_RX: stm32h750xbh6-sig (U600.U2), debug (U1107.2)
DBG_A_TX: stm32h750xbh6-sig (U600.A11), debug (U1107.1)
DBG_B_RX: stm32h750xbh6-sig (U600.P12), debug (U1107.4)
DBG_B_TX: stm32h750xbh6-sig (U600.P11), debug (U1107.3)
DBG_C_RX: stm32h750xbh6-sig (U600.N4), debug (U1113.2)
DBG_C_TX: stm32h750xbh6-sig (U600.N5), debug (U1113.1)
DBG_D_RX: stm32h750xbh6-sig (U600.D12), debug (U1113.4)
DBG_D_TX: stm32h750xbh6-sig (U600.C12), debug (U1113.3)
DBG_MISO: stm32h750xbh6-sig (U600.M3), debug (R1115.2)
DBG_MOSI: stm32h750xbh6-sig (R764.2), debug (U1114.14)
DBG_SCL: stm32h750xbh6-sig (U600.R17), debug (U1112.3)
DBG_SCLK: stm32h750xbh6-sig (R727.2), debug (U1114.15)
DBG_SDA: stm32h750xbh6-sig (U600.R16), debug (U1112.2)
DE: stm32h750xbh6-sig (U600.D7), lcd (J800.9 U800.2 U800.9)
DM0: is42s32800j (U400.K9), stm32h750xbh6-sig (R733.2)
DM1: is42s32800j (U400.K1), stm32h750xbh6-sig (R735.2)
DM2: is42s32800j (U400.F8), stm32h750xbh6-sig (R710.2)
DM3: is42s32800j (U400.F2), stm32h750xbh6-sig (R713.2)
DRV_AH: drv8323 (U300.37), stm32h750xbh6-sig (R719.2)
DRV_BH: drv8323 (U300.39), stm32h750xbh6-sig (R723.2)
DRV_CAL: drv8323 (U300.34), stm32h750xbh6-sig (U600.H17)
DRV_CH: drv8323 (U300.41), stm32h750xbh6-sig (R726.2)
DRV_CS: drv8323 (R311.1), stm32h750xbh6-sig (R708.2)
DRV_EN: drv8323 (R306.2 U300.33), stm32h750xbh6-sig (U701.4)
DRV_FLT: drv8323 (R308.1), stm32h750xbh6-sig (U600.H16)
DRV_SCLK: drv8323 (R312.1), stm32h750xbh6-sig (R711.2)
DRV_SDI: drv8323 (U300.30), stm32h750xbh6-sig (R715.2)
DRV_SDO: drv8323 (R313.1), stm32h750xbh6-sig (U600.R3)
DRV_SNS_A: drv8323 (R316.1), stm32h750xbh6-sig (U600.T1)
DRV_SNS_B: drv8323 (R317.1), stm32h750xbh6-sig (U600.T2)
DRV_SNS_BUS: drv8323 (C308.1 R322.2 R323.2), stm32h750xbh6-sig (U600.U4)
DRV_SNS_C: drv8323 (R319.1), stm32h750xbh6-sig (U600.T4)
EMMC_CLK: stm32h750xbh6-sig (U600.B11), klmag2gend-b031 (R918.1)
EMMC_D0: stm32h750xbh6-sig (U600.U15), klmag2gend-b031 (R900.2 R901.1)
EMMC_D1: stm32h750xbh6-sig (U600.T15), klmag2gend-b031 (R902.2 R903.1)
EMMC_D2: stm32h750xbh6-sig (U600.B9), klmag2gend-b031 (R904.2 R905.1)
EMMC_D3: stm32h750xbh6-sig (U600.B7), klmag2gend-b031 (R906.2 R907.1)
EMMC_D4: stm32h750xbh6-sig (U600.D5), klmag2gend-b031 (R908.2 R909.1)
EMMC_D5: stm32h750xbh6-sig (U600.D4), klmag2gend-b031 (R910.2 R911.1)
EMMC_D6: stm32h750xbh6-sig (U600.F14), klmag2gend-b031 (R912.2 R913.1)
EMMC_D7: stm32h750xbh6-sig (U600.F13), klmag2gend-b031 (R914.2 R915.1)
FR_DBG1: stm32h750xbh6-sig (C701.1 R784.1 U600.E7), debug (U1108.4)
FR_DBG2: stm32h750xbh6-sig (U600.E4), debug (U1109.6)
FR_DBG3: stm32h750xbh6-sig (U600.F4), debug (U1109.4)
G0: stm32h750xbh6-sig (U600.T5), lcd (J800.24 U804.1 U804.10)
G1: stm32h750xbh6-sig (U600.U5), lcd (J800.20 U803.1 U803.10)
G2: stm32h750xbh6-sig (U600.P5), lcd (J800.27 U804.5 U804.6)
G3: stm32h750xbh6-sig (U600.A9), lcd (J800.26 U804.4 U804.7)
G4: stm32h750xbh6-sig (U600.K14), lcd (J800.25 U804.2 U804.9)
G5: stm32h750xbh6-sig (U600.J14), lcd (J800.23 U803.5 U803.6)
G6: stm32h750xbh6-sig (U600.J15), lcd (J800.22 U803.4 U803.7)
G7: stm32h750xbh6-sig (U600.B12), lcd (J800.21 U803.2 U803.9)
HSYNC: stm32h750xbh6-sig (U600.H1), lcd (J800.11 U800.5 U800.6)
LCD_INT: stm32h750xbh6-sig (U600.D10), lcd (R800.2)
LCD_R0: stm32h750xbh6-sig (U600.D9), lcd (J800.28 U805.1 U805.10)
LCD_R1: stm32h750xbh6-sig (U600.N6), lcd (J800.32 U806.1 U806.10)
LCD_R2: stm32h750xbh6-sig (U600.P6), lcd (J800.35 U806.5 U806.6)
LCD_R3: stm32h750xbh6-sig (U600.T6), lcd (J800.34 U806.4 U806.7)
LCD_R4: stm32h750xbh6-sig (U600.U6), lcd (J800.33 U806.2 U806.9)
LCD_R5: stm32h750xbh6-sig (U600.U7), lcd (J800.31 U805.5 U805.6)
LCD_R6: stm32h750xbh6-sig (U600.E15), lcd (J800.30 U805.4 U805.7)
LCD_R7: stm32h750xbh6-sig (U600.G15), lcd (J800.29 U805.2 U805.9)
LCD_RST: stm32h750xbh6-sig (U600.E10), lcd (J800.8 U800.1 U800.10)
LCD_SCL: stm32h750xbh6-sig (U600.P3), lcd (R801.2)
LCD_SDA: stm32h750xbh6-sig (U600.P4), lcd (R802.2)
LCD_VSYNC: stm32h750xbh6-sig (U600.H2), lcd (J800.10 U800.4 U800.7)
NOR_CS: stm32h750xbh6-sig (R777.2), mx25l25645gz2i-08g (R1000.1 U1000.1 U1001.1)
NOR_IO0: stm32h750xbh6-sig (R773.2), mx25l25645gz2i-08g (R1001.1)
NOR_IO1: stm32h750xbh6-sig (R774.2), mx25l25645gz2i-08g (R1003.1)
NOR_IO2: stm32h750xbh6-sig (R771.2), mx25l25645gz2i-08g (R1005.1)
NOR_IO3: stm32h750xbh6-sig (R770.2), mx25l25645gz2i-08g (R1007.1)
NOR_IO4: stm32h750xbh6-sig (R734.2), mx25l25645gz2i-08g (R1002.1)
NOR_IO5: stm32h750xbh6-sig (R736.2), mx25l25645gz2i-08g (R1004.1)
NOR_IO6: stm32h750xbh6-sig (R721.2), mx25l25645gz2i-08g (R1006.1)
NOR_IO7: stm32h750xbh6-sig (R730.2), mx25l25645gz2i-08g (R1008.1)
NOR_SCLK: stm32h750xbh6-sig (R776.2), mx25l25645gz2i-08g (U1000.6 U1001.6)
NRST: stm32h750xbh6-sig (C700.1 R772.2 U600.K1 U701.1), klmag2gend-b031 (R920.2 R921.1), debug (R1106.1)
SDRAM_CAS: is42s32800j (U400.K7), stm32h750xbh6-sig (R732.2)
SDRAM_CKE: is42s32800j (U400.J2), stm32h750xbh6-sig (R741.2)
SDRAM_CLK: is42s32800j (U400.J1), stm32h750xbh6-sig (R718.2)
SDRAM_CS: is42s32800j (U400.J8), stm32h750xbh6-sig (R743.2)
SDRAM_RAS: is42s32800j (U400.J9), stm32h750xbh6-sig (R778.2)
SDRAM_WE: is42s32800j (U400.K8), stm32h750xbh6-sig (R762.2)
SWCLK: stm32h750xbh6-sig (U600.B14), debug (R1103.1)
SWDIO: stm32h750xbh6-sig (R728.2), debug (R1104.1)
SWO: stm32h750xbh6-sig (R738.2), debug (U1100.8)
T0: stm32h750xbh6-sig (R739.2), debug (U1104.14)
T1: stm32h750xbh6-sig (R740.2), debug (U1104.13)
T2: stm32h750xbh6-sig (R742.2), debug (U1104.12)
T3: stm32h750xbh6-sig (R744.2), debug (U1104.11)
TCLK: stm32h750xbh6-sig (R737.2), debug (U1104.15)
TMP_CH0: stm32h750xbh6-sig (U600.M4 U600.N3), tempature (C1201.1 R1204.1 U1201.1)
TO_DBG0: stm32h750xbh6-sig (U600.R15), debug (U1105.1)
TO_DBG1: stm32h750xbh6-sig (U600.N14), debug (U1105.3)
TO_DBG2: stm32h750xbh6-sig (U600.M14), debug (U1106.1)
TO_DBG3: stm32h750xbh6-sig (U600.L14), debug (U1106.3)